# EAGLE design FREEPIXEL (EAGLE 6.5.0)
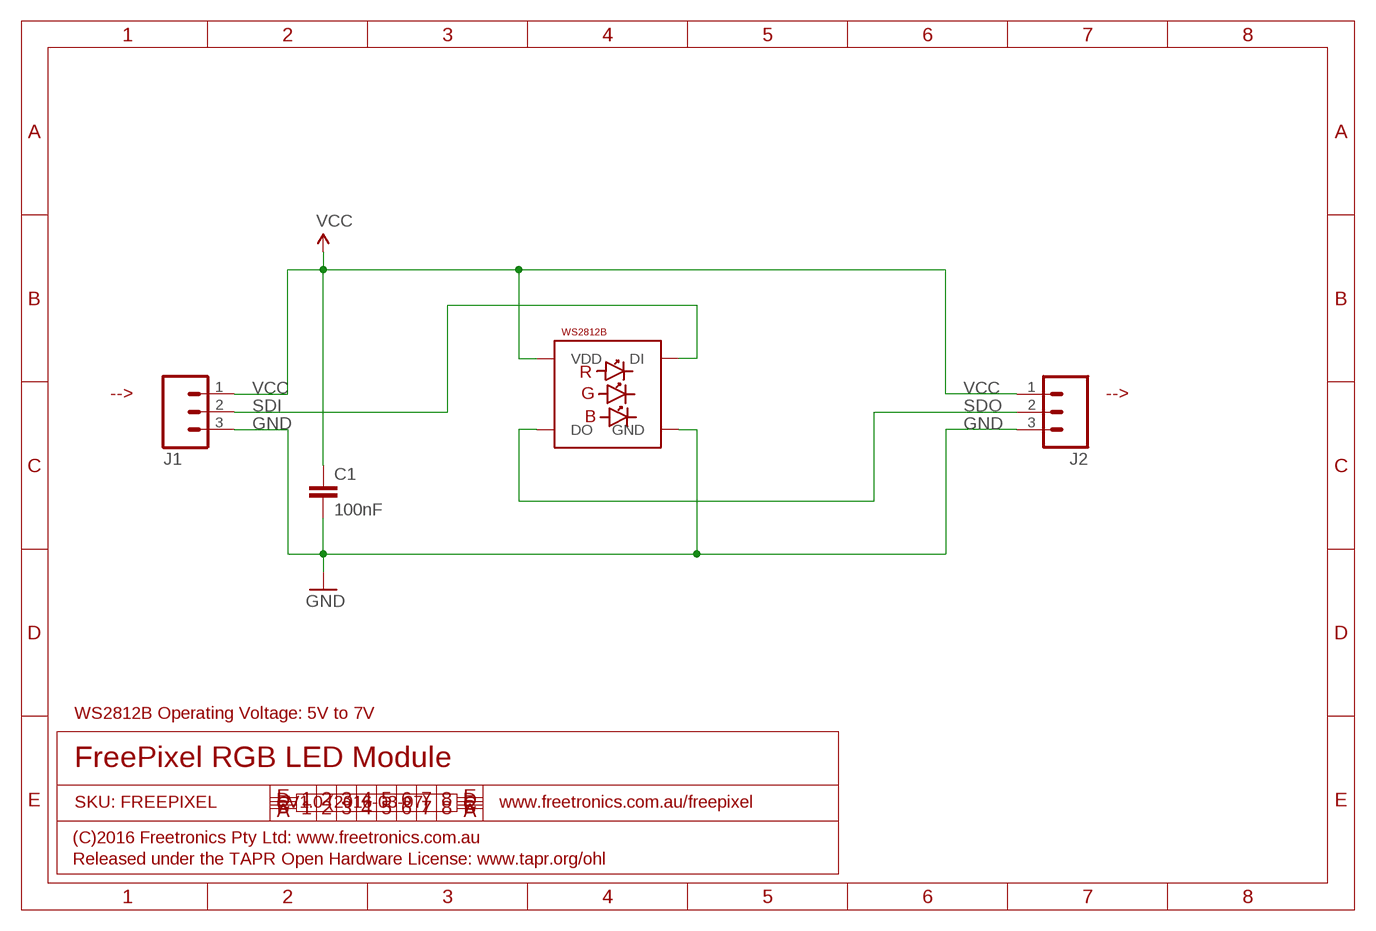
[diagram p0: schematic, sheet 1]

## Parts
C1  100nF  CAP0603  [0603]
J1  M03PTH  [1X03]
J2  M03PTH  [1X03]
LED1  WS2812B5050  [WS2812B]

## Nets
GND: C1.2 J1.3 J2.3 LED1.3-GND(GND)
SDI: J1.2 LED1.4-DIN(DI)
SDO: J2.2 LED1.2-DOUT(DO)
VCC: C1.1 J1.1 J2.1 LED1.1-VDD(VDD)

## Notes on the sheet
- --> | -->
- WS2812B Operating Voltage: 5V to 7V
- FreePixel RGB LED Module
- SKU: FREEPIXEL | V1.0 (2016-03-07) | www.freetronics.com.au/freepixel
- (C)2016 Freetronics Pty Ltd: www.freetronics.com.au
- Released under the TAPR Open Hardware License: www.tapr.org/ohl

## Library data of the parts
C1 = freetronics-master-v1:CAP: Capacitor Standard 0603 ceramic capacitor, and 0.1" leaded capacitor.
J1 J2 = freetronics-jon:M03: Header 3 Standard 3-pin 0.1" header. Use with straight break away headers (SKU : PRT-00116), right angle break away headers (PRT-00553), swiss pins (PRT-00743), machine pins (PRT-00117), and female headers (PRT-00115). Molex polarized connector foot print use with SKU : PRT-08232 with associated crimp pins and housings.
LED1 = freetronics-jon:WS2812B

## Board
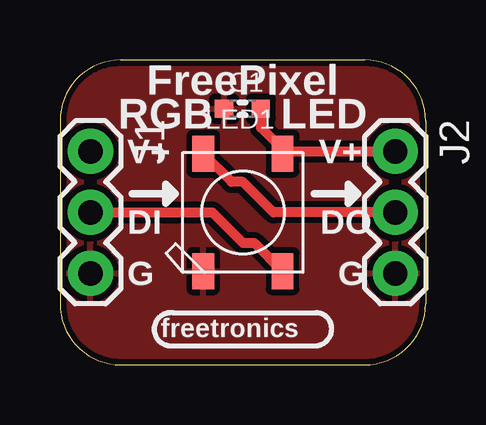
[diagram p1: board, top side]
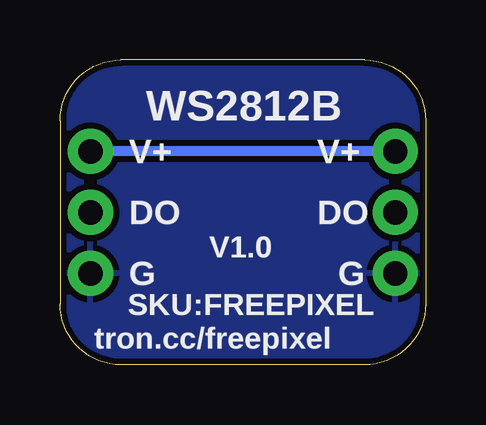
[diagram p2: board, bottom side, seen from below]

Size 15.24 x 12.7 mm. Coordinates in mm from the lower left corner, seen from the top.
Outline: 0,2.54 arc90 2.54,0 12.7,0 arc90 15.24,2.54 15.24,10.16 arc90 12.7,12.7 2.54,12.7 arc90 0,10.16 0,2.54
Copper layers (1*16): Top 0.035mm / dielectric 1.5mm / Bottom 0.035mm
Design rules "default *": minimum track width 8mil, minimum drill 15mil, track to track 10mil, track to pad 10mil, pad to pad 10mil, via to via 10mil, smd to smd 8mil, copper to edge 10mil, drill to drill 8mil, minimum pad ring 14mil, minimum via ring 8mil, stop-mask expansion 4mil, vias tented up to drill 25mil, thermal gap 10mil

### Footprints (pad centres in the part's own frame; a part is rotated, then mirrored left to right if it is on the bottom)
0603 = smd 0.762 x 0.762: 1 -0.762,0; 2 0.762,0
1X03 = drill 1.016 pad 1.88: 1 0,0; 2 2.54,0; 3 5.08,0
WS2812B = smd 1.5 x 0.9: 1-VDD 2.45,-1.65; 2-DOUT 2.45,1.65; 3-GND -2.45,1.65; 4-DIN -2.45,-1.65

### Placement (x,y rotation side)
C1  7.6,10.67 180 top
J1  1.27,8.89 270 top
J2  13.97,8.89 270 top
LED1  7.62,6.35 90 top

### Tracks (layer width: path | path; a pad name or v marks a point on that pad's centre or on a via)
GND
  pour Top: 0,10.16 arc-90 2.54,12.7 12.7,12.7 arc-90 15.24,10.16 15.24,2.54 arc-90 12.7,0 2.54,0 arc-90 0,2.54
  pour Bottom: 0,10.16 arc-90 2.54,12.7 12.7,12.7 arc-90 15.24,10.16 15.24,2.54 arc-90 12.7,0 2.54,0 arc-90 0,2.54
SDI
  Top 0.406: J1.2 6.35,6.35 7.62,5.08 8.09,5.08 LED1.4-DIN
SDO
  Top 0.406: J2.2 8.89,6.35 7.62,7.62 7.15,7.62 LED1.2-DOUT
VCC
  Top 0.406: LED1.1-VDD 9.36,8.89 | 9.36,8.89 J2.1 | 9.36,8.89 8.38,9.87 C1.1
  Bottom 0.406: J1.1 J2.1

### Text on the board
tPlace: FreePixel | RGB | LED | V+ | V+ | DI | DO | G | G | freetronics
bPlace: WS2812B | V+ | V+ | DO | DO | V1.0 | G | G | SKU:FREEPIXEL | tron.cc/freepixel